# Altium schematic sheet rev02_0.SchDoc
size 409 x 282 mm
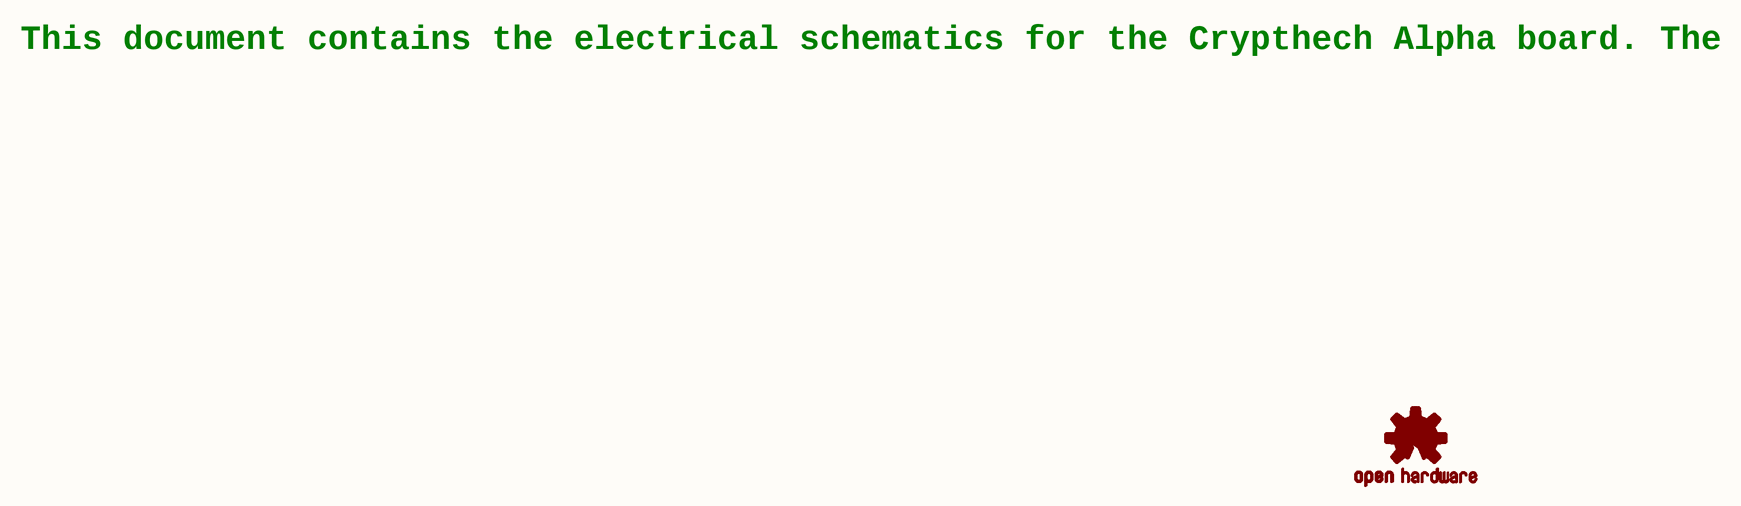
[diagram p0: rev02_0.SchDoc]

## Parts
LOGO1  OSHW-LOGOL-COPPER  [OSHW-LOGO-L_COPPER]  (value not drawn)

## Notes on the sheet
- This document contains the electrical schematics for the Crypthech Alpha board.
  The latest version of these schematics can be found here:
  https://wiki.cryptech.is/browser/hardware/eagle/alpha
  For more information about the Alpha board including functionality, goals
  and block diagram, please see:
  https://wiki.cryptech.is/wiki/AlphaBoardStrategy
  For more information about the Cryptech project, please see:
  https://cryptech.is/

## Library data of the parts
LOGO1 = OSHW-LOGOL-COPPER: Open Source Hardware Logo as defined here :http://freedomdefined.org/OSHW